# EAGLE design LilyPad-reed (EAGLE 7.2.0)
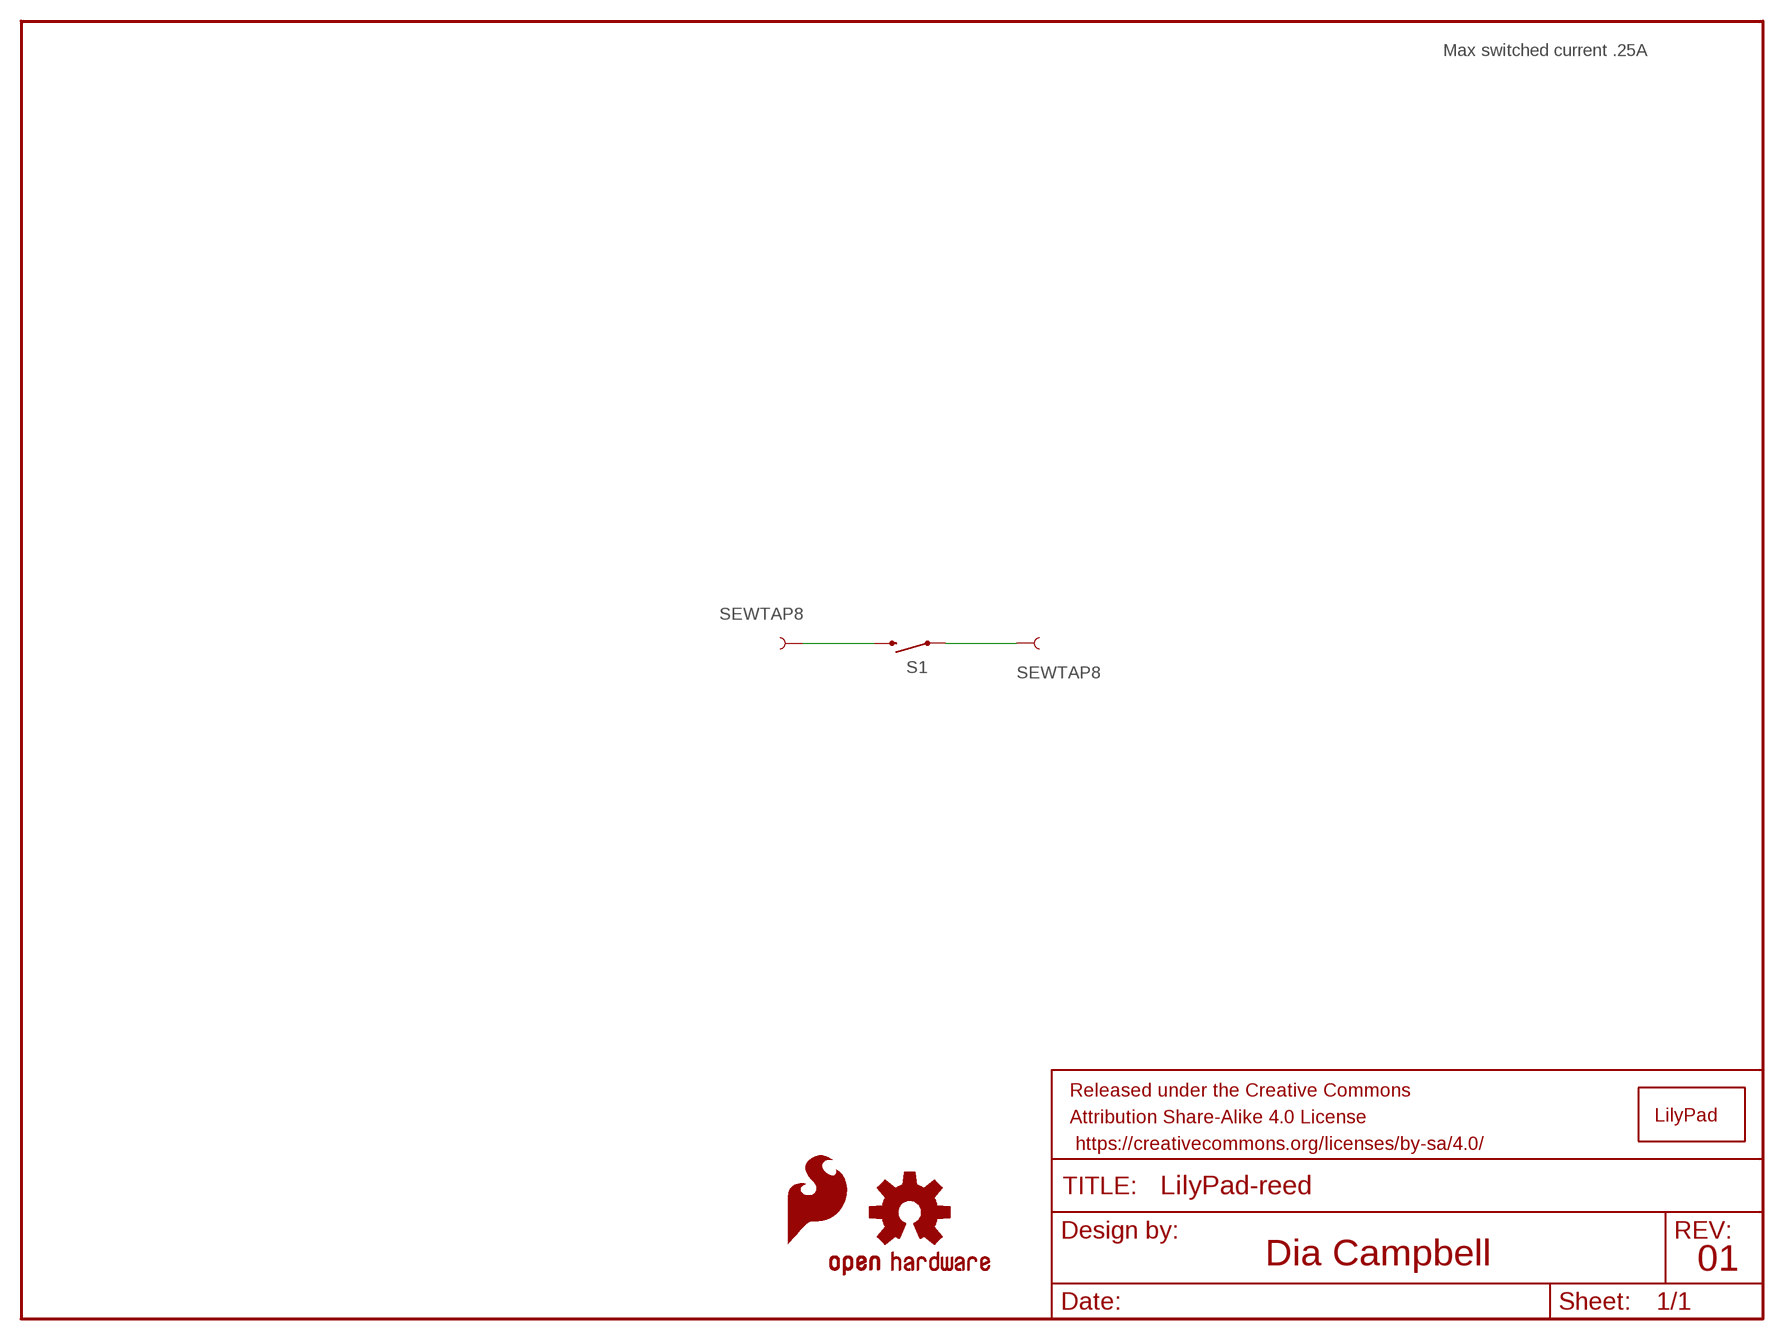
[diagram p0: schematic, sheet 1]

## Parts
FRAME1  FRAME-LETTER  [CREATIVE_COMMONS]
LOGO1  OSHW-LOGOS-COPPER  [OSHW-LOGO-S_COPPER]
LOGO2  SFE_LOGO_FLAME.1COP  [SFE_LOGO_FLAME_COPPER_.1]
S1  REED  SWITCH-MOMENTARY-2PTH_REED2  [REED_SWITCH_PLASTIC]
SLIDEOFF  SEWTAP8  [PETAL-MEDIUM-2SIDE]
SLIDEON  SEWTAP8  [PETAL-MEDIUM-2SIDE]
U$1  LOGO-LPLP  [LOGO-LILYPAD]

## Nets
N$1: S1.P$2 SLIDEOFF.1
N$2: S1.P$1 SLIDEON.1

## Notes on the sheet
- Max switched current .25A
- Dia Campbell | 01

## Library data of the parts
FRAME1 = SparkFun-Aesthetics:FRAME-LETTER: Schematic Frame Standard 8.5x11 US Letter frame; DESIGNER: NAME; VERSION: v01
LOGO1 = SparkFun-Aesthetics:OSHW-LOGO: Open Source Hardware Logo This logo indicates the piece of hardware it is found on incorporates a OSHW license and/or adheres to the definition of open source hardware found here: http://freedomdefined.org/OSHW
LOGO2 = SparkFun-Aesthetics:SFE_LOGO_FLAME: SFE Logo, flame only This is the SparkFun flame logo. The logo on the schematic will always be the same size; the package variant is the height of the flame. Default layer for the logo on the board is tSilk.
S1 = SparkFun-Electromechanical:SWITCH-MOMENTARY-2: Various NO switches- pushbuttons, reed, etc; PROD_ID: SWCH-10467
SLIDEOFF SLIDEON = LilyPad-Wearables:SEWTAP: Sew Taps for LilyPad Boards.
U$1 = LilyPad-Wearables:LOGO-LP

## Board
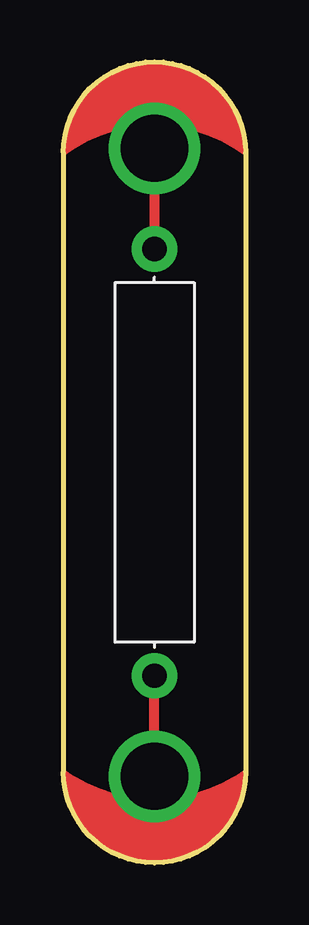
[diagram p1: board, top side]
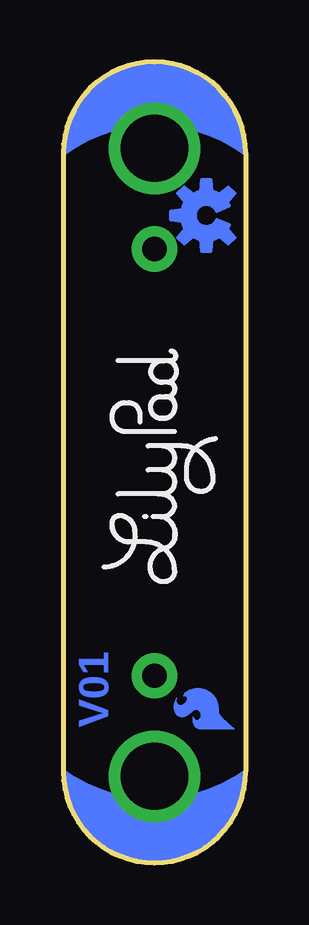
[diagram p2: board, bottom side, seen from below]

Size 7.6 x 33.38 mm. Coordinates in mm from the lower left corner, seen from the top.
Outline: 0,29.58 arc-180 7.6,29.58 7.6,3.8 arc-180 0,3.8 0,29.58
Copper layers (1*16): Top 0.035mm / dielectric 1.5mm / Bottom 0.035mm
Design rules "SparkFun-2-layer": minimum track width 7mil, minimum drill 15mil, track to track 8mil, track to pad 8mil, pad to pad 8mil, via to via 8mil, smd to smd 8mil, copper to edge 8mil, drill to drill 8mil, minimum pad ring 12mil, minimum via ring 10mil, stop-mask expansion 4mil, vias tented up to drill 20mil, thermal gap 10mil

### Footprints (pad centres in the part's own frame; a part is rotated, then mirrored left to right if it is on the bottom)
REED_SWITCH_PLASTIC = drill 1.016 pad 1.88: P$1 -8.89,0; P$2 8.89,0
PETAL-MEDIUM-2SIDE = drill 2.794: 1 0,-0.254

### Placement (x,y rotation side)
FRAME1  -20.62,-21.41 0 top  (outside the outline)
LOGO1  1.64,26.98 90 bottom
LOGO2  0.12,5.26 90 bottom
S1  3.8,16.69 270 top
SLIDEOFF  3.8,3.86 0 top
SLIDEON  3.8,29.52 180 top
U$1  3.93,16.56 90 bottom

### Tracks (layer width: path | path; a pad name or v marks a point on that pad's centre or on a via)
N$1
  Top 0.406: SLIDEOFF.1 S1.P$2
N$2
  Top 0.406: SLIDEON.1 S1.P$1

### Text on the board
Bottom: V01
Measures: Dimensions in inches
tDocu: purple 0.8mm | Dia Campbell
bDocu: purple 0.08mm